# EAGLE design Genesis - Multitap (EAGLE 9.6.2)
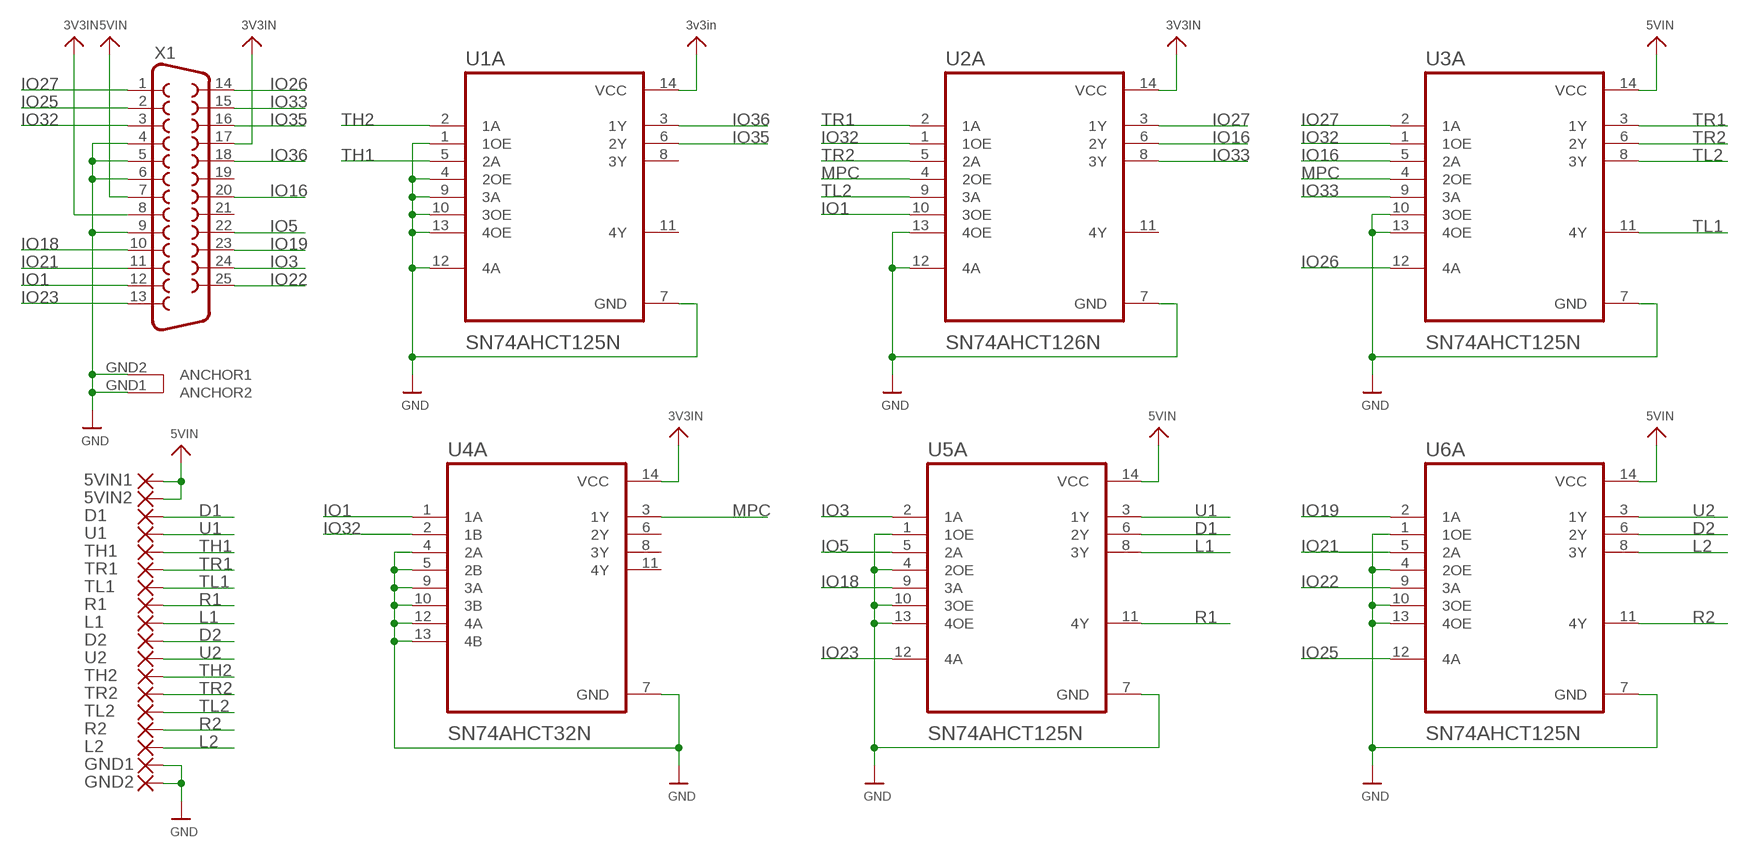
[diagram p0: schematic, sheet 1]

## Parts
5VIN1  SMD5  [SMD2,54-5,08]
5VIN2  SMD5  [SMD2,54-5,08]
D1  SMD5  [SMD2,54-5,08]
D2  SMD5  [SMD2,54-5,08]
GND1  SMD5  [SMD2,54-5,08]
GND2  SMD5  [SMD2,54-5,08]
L1  SMD5  [SMD2,54-5,08]
L2  SMD5  [SMD2,54-5,08]
R1  SMD5  [SMD2,54-5,08]
R2  SMD5  [SMD2,54-5,08]
TH1  SMD5  [SMD2,54-5,08]
TH2  SMD5  [SMD2,54-5,08]
TL1  SMD5  [SMD2,54-5,08]
TL2  SMD5  [SMD2,54-5,08]
TR1  SMD5  [SMD2,54-5,08]
TR2  SMD5  [SMD2,54-5,08]
U1  SMD5  [SMD2,54-5,08]
U1A  SN74AHCT125N  [DIP794W45P254L1969H508Q14]
U2  SMD5  [SMD2,54-5,08]
U2A  SN74AHCT126N  SN74AHCT125N  [DIP794W45P254L1969H508Q14]
U3A  SN74AHCT125N  [DIP794W45P254L1969H508Q14]
U4A  SN74AHCT32N  [DIP794W45P254L1969H508Q14]
U5A  SN74AHCT125N  [DIP794W45P254L1969H508Q14]
U6A  SN74AHCT125N  [DIP794W45P254L1969H508Q14]
X1  DB25_FEMALEHP  [F25HP]

## Nets
3V3IN: U1A.14(VCC) U2A.14(VCC) U4A.14(VCC) X1.8 X1.17 ; supply symbol labelled 3v3in
5VIN: 5VIN1.1(P) 5VIN2.1(P) U3A.14(VCC) U5A.14(VCC) U6A.14(VCC) X1.7
D1: D1.1(P) U5A.6(2Y)
D2: D2.1(P) U6A.6(2Y)
GND: GND1.1(P) GND2.1(P) U1A.1(1OE) U1A.4(2OE) U1A.7(GND) U1A.9(3A) U1A.10(3OE) U1A.12(4A) U1A.13(4OE) U2A.7(GND) U2A.12(4A) U2A.13(4OE) U3A.7(GND) U3A.10(3OE) U3A.13(4OE) U4A.4(2A) U4A.5(2B) U4A.7(GND) U4A.9(3A) U4A.10(3B) U4A.12(4A) U4A.13(4B) U5A.1(1OE) U5A.4(2OE) U5A.7(GND) U5A.10(3OE) U5A.13(4OE) U6A.1(1OE) U6A.4(2OE) U6A.7(GND) U6A.10(3OE) U6A.13(4OE) X1.4 X1.5 X1.6 X1.9 X1.GND1(ANCHOR2) X1.GND2(ANCHOR1)
IO1: U2A.10(3OE) U4A.1(1A) X1.12
IO3: U5A.2(1A) X1.24
IO5: U5A.5(2A) X1.22
IO16: U2A.6(2Y) U3A.5(2A) X1.20
IO18: U5A.9(3A) X1.10
IO19: U6A.2(1A) X1.23
IO21: U6A.5(2A) X1.11
IO22: U6A.9(3A) X1.25
IO23: U5A.12(4A) X1.13
IO25: U6A.12(4A) X1.2
IO26: U3A.12(4A) X1.14
IO27: U2A.3(1Y) U3A.2(1A) X1.1
IO32: U2A.1(1OE) U3A.1(1OE) U4A.2(1B) X1.3
IO33: U2A.8(3Y) U3A.9(3A) X1.15
IO35: U1A.6(2Y) X1.16
IO36: U1A.3(1Y) X1.18
L1: L1.1(P) U5A.8(3Y)
L2: L2.1(P) U6A.8(3Y)
MPC: U2A.4(2OE) U3A.4(2OE) U4A.3(1Y)
R1: R1.1(P) U5A.11(4Y)
R2: R2.1(P) U6A.11(4Y)
TH1: TH1.1(P) U1A.5(2A)
TH2: TH2.1(P) U1A.2(1A)
TL1: TL1.1(P) U3A.11(4Y)
TL2: TL2.1(P) U2A.9(3A) U3A.8(3Y)
TR1: TR1.1(P) U2A.2(1A) U3A.3(1Y)
TR2: TR2.1(P) U2A.5(2A) U3A.6(2Y)
U1: U1.1(P) U5A.3(1Y)
U2: U2.1(P) U6A.3(1Y)
Unconnected: U1A.8(3Y) U1A.11(4Y) U2A.11(4Y) U4A.6(2Y) U4A.8(3Y) U4A.11(4Y) X1.19 X1.21

## Library data of the parts
5VIN1 5VIN2 D1 D2 GND1 GND2 L1 L2 R1 R2 TH1 TH2 TL1 TL2 TR1 TR2 U1 U2 = wirepad:SMD5: SMD PAD
U1A U2A U3A U5A U6A = SN74AHCT125N:SN74AHCT125N: None Check prices <https://pricing.snapeda.com/parts/SN74AHCT125N/Texas%20Instruments/view-part?ref=eda>; AVAILABILITY: In Stock; DESCRIPTION: Quadruple Bus Buffer Gates With 3-State Outputs 14-PDIP -40 to 125; MF: Texas Instruments; MP: SN74AHCT125N; PACKAGE: PDIP-14 Texas Instruments; PRICE: None; PURCHASE-URL: https://pricing.snapeda.com/search/part/SN74AHCT125N/?ref=eda
U4A = SN74AHCT32N:SN74AHCT32N; DESCRIPTION: 4-ch, 2-input, 4.5-V to 5.5-V OR gates with TTL-compatible CMOS inputs; DIGI-KEY_PART_NUMBER: 2156-SN74AHCT32N-ND; MF: Texas Instruments; MP: SN74AHCT32N; PACKAGE: PDIP-14 Texas Instruments; PURCHASE-URL: https://pricing.snapeda.com/search/part/SN74AHCT32N/?ref=eda
X1 = SparkFun-Retired:DB25_FEMALE: 25 Pin male connector. PCB edge mount for regular PCB thicknesses. This connector will connect directly to the back of a PC parallel port or through a normal DB25 extension cable (M/F). SKU: PRT-08287

## Board
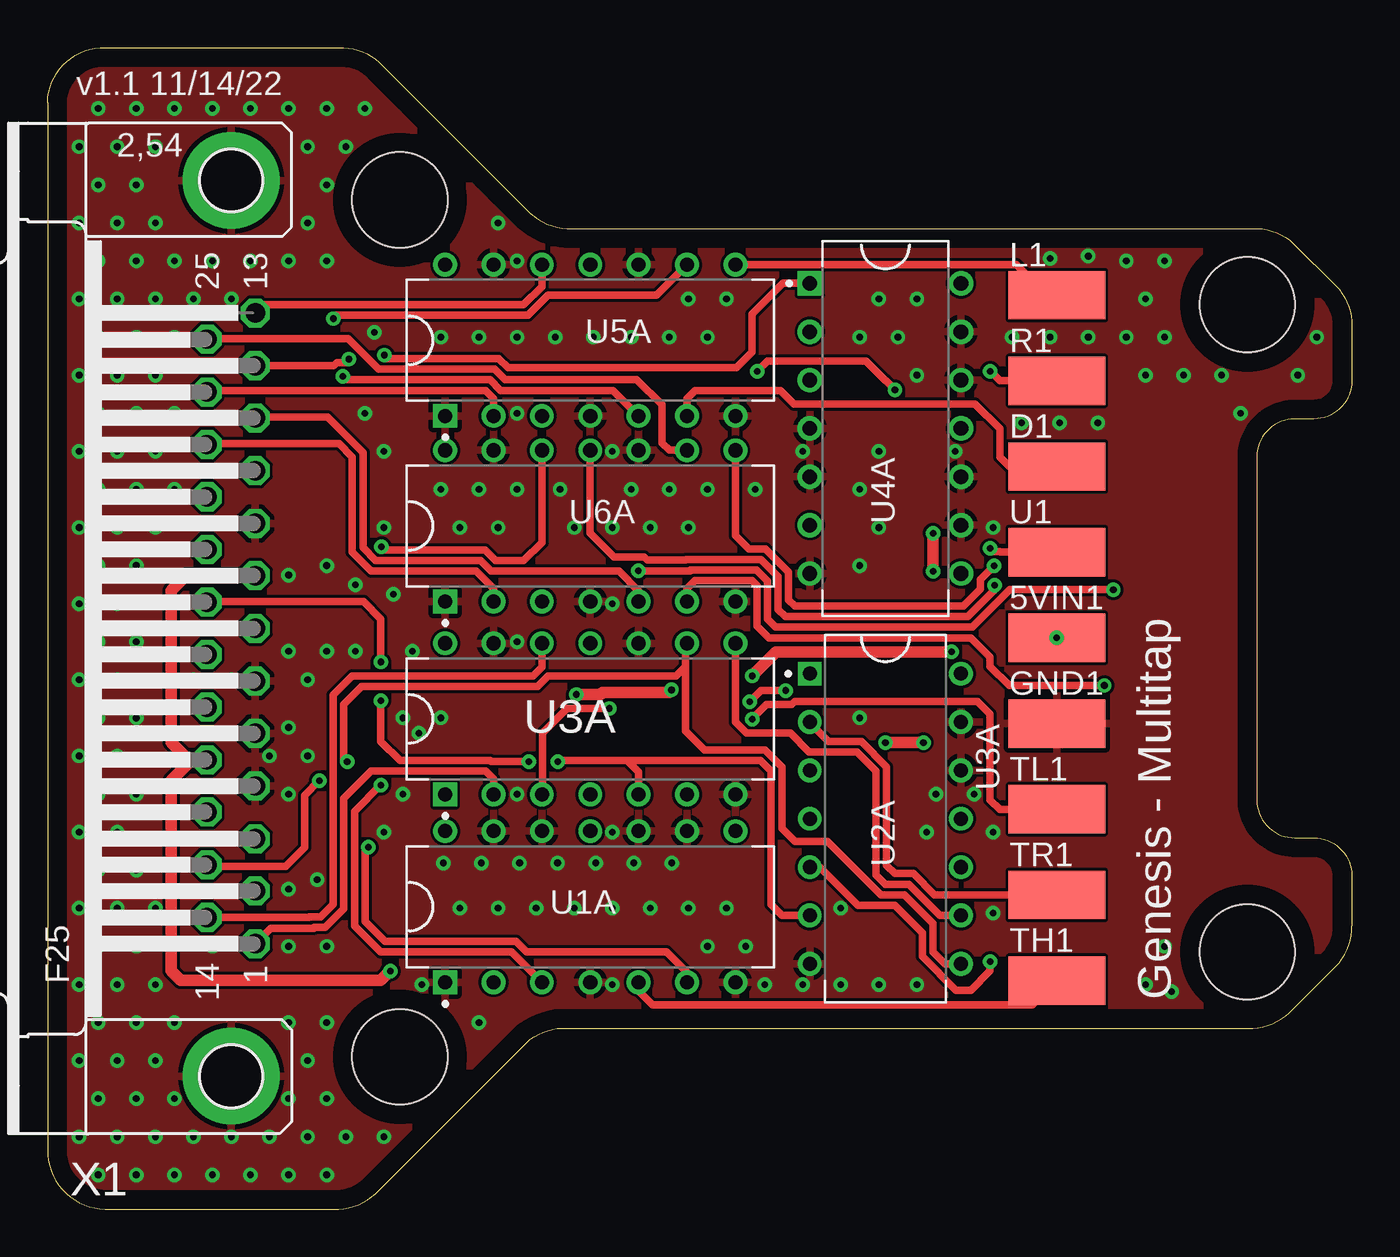
[diagram p1: board, top side]
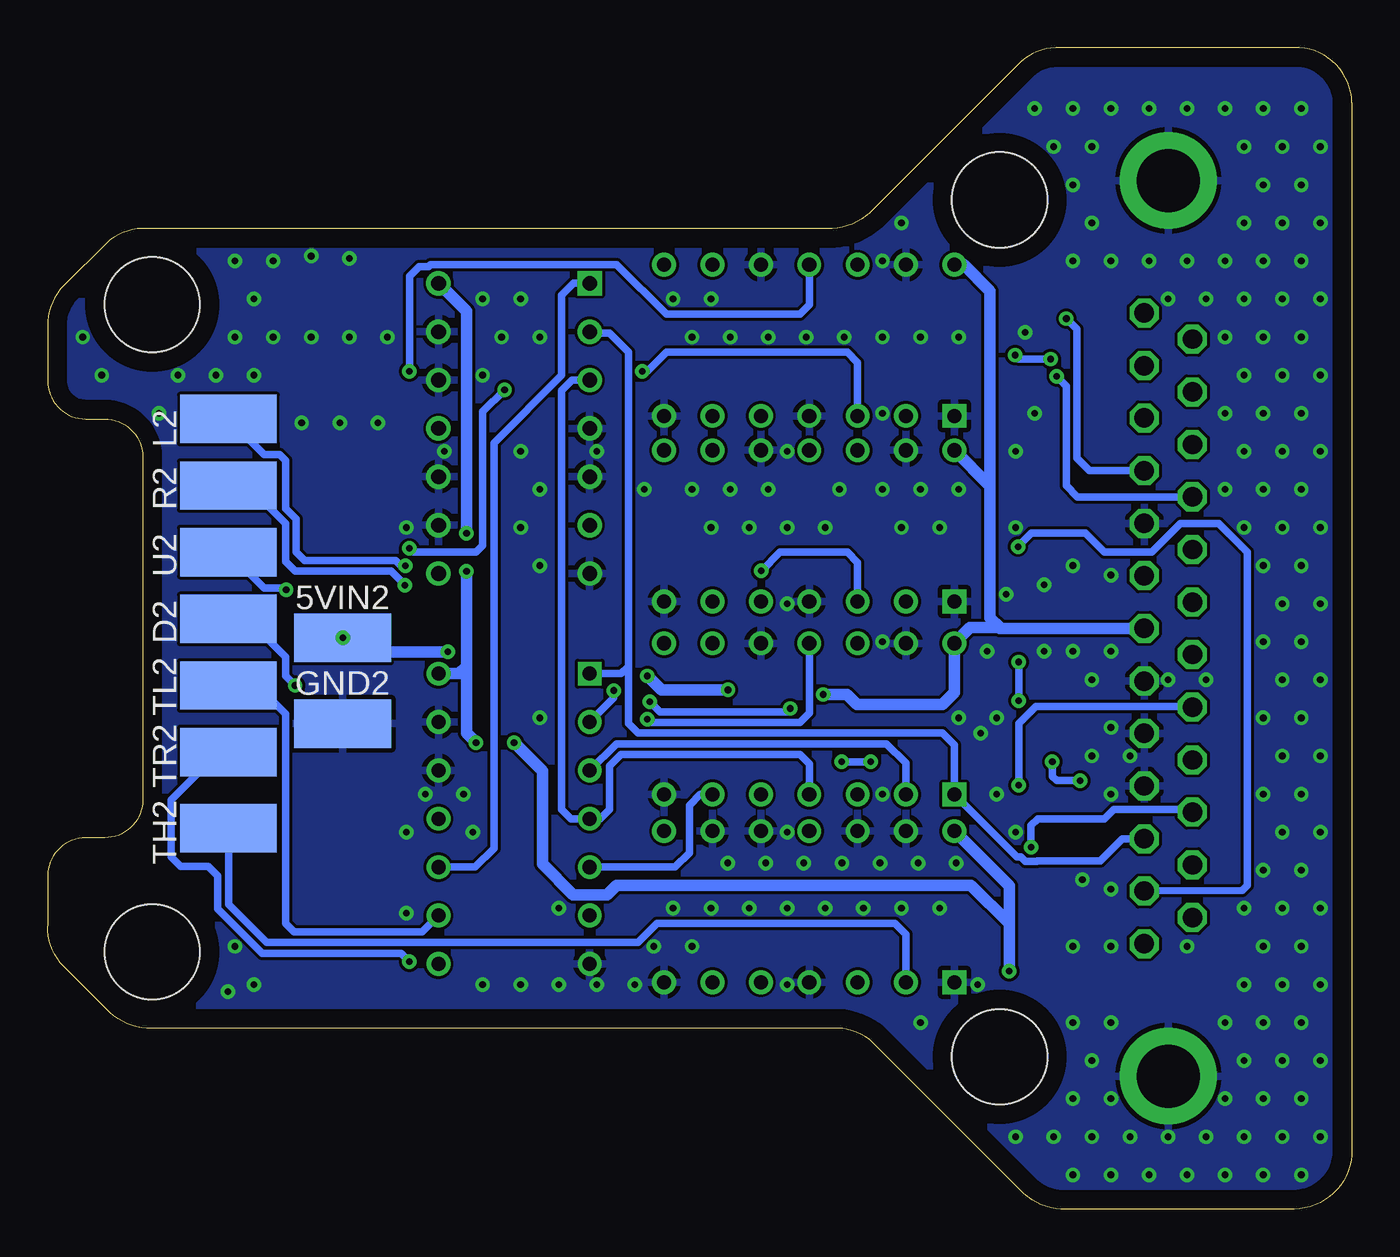
[diagram p2: board, bottom side, seen from below]

Size 68.5 x 61 mm. Coordinates in mm from the lower left corner, seen from the top.
Outline: 0,58.12 0,3.12 arc90 3.03,0 15.29,0 arc45 17.41,1 25.15,8.74 arc-45 27.27,9.5 63.29,9.5 arc45 65.41,10.5 67.65,12.74 arc45 68.5,14.86 68.5,17.5 arc90 66.5,19.5 65.5,19.5 arc-90 63.5,21.5 63.5,39.5 arc-90 65.5,41.5 66.5,41.5 arc90 68.5,43.5 68.5,46.38 arc45 67.65,48.5 65.41,50.74 arc45 63.29,51.5 27.27,51.5 arc-45 25.15,52.5 17.41,60.24 arc45 15.29,61 3.03,61 arc90 0,58.12
Copper layers (1*16): Top 0.035mm / dielectric 1.5mm / Bottom 0.035mm
Design rules "default": minimum track width 6mil, minimum drill 0.35mm, track to track 6mil, track to pad 6mil, pad to pad 6mil, via to via 6mil, smd to smd 6mil, copper to edge 40mil, drill to drill 6mil, minimum pad ring 10mil, minimum via ring 8mil, stop-mask expansion 4mil, vias tented up to drill 0.5mm, thermal gap 10mil
Holes 5 mm at 63,13.5 63,47.5 18.5,53 18.5,8

### Footprints (pad centres in the part's own frame; a part is rotated, then mirrored left to right if it is on the bottom)
SMD2,54-5,08 = smd 2.54 x 5.08: 1 0,0
DIP794W45P254L1969H508Q14 = drill 0.74 pad 1.14 square: 1 -3.97,7.62 | drill 0.74 pad 1.14: 2 -3.97,5.08; 3 -3.97,2.54; 4 -3.97,0; 5 -3.97,-2.54; 6 -3.97,-5.08; 7 -3.97,-7.62; 8 3.97,-7.62; 9 3.97,-5.08; 10 3.97,-2.54; 11 3.97,0; 12 3.97,2.54; 13 3.97,5.08; 14 3.97,7.62
DIP794W45P254L1969H508Q14' = drill 0.77 pad 1.17 square: 1 -3.97,7.62 | drill 0.77 pad 1.17: 2 -3.97,5.08; 3 -3.97,2.54; 4 -3.97,0; 5 -3.97,-2.54; 6 -3.97,-5.08; 7 -3.97,-7.62; 8 3.97,-7.62; 9 3.97,-5.08; 10 3.97,-2.54; 11 3.97,0; 12 3.97,2.54; 13 3.97,5.08; 14 3.97,7.62
F25HP = drill 1.016 octagon: 1 -16.561,-1.27; 2 -13.792,-1.27; 3 -11.049,-1.27; 4 -8.28,-1.27; 5 -5.512,-1.27; 6 -2.769,-1.27; 7 0,-1.27; 8 2.769,-1.27; 9 5.512,-1.27; 10 8.28,-1.27; 11 11.049,-1.27; 12 13.792,-1.27; 13 16.561,-1.27; 14 -15.189,1.27; 15 -12.421,1.27; 16 -9.652,1.27; 17 -6.909,1.27; 18 -4.14,1.27; 19 -1.372,1.27; 20 1.372,1.27; 21 4.14,1.27; 22 6.909,1.27; 23 9.652,1.27; 24 12.421,1.27; 25 15.189,1.27 | drill 3.302 pad 5.08: GND1 -23.52,0; GND2 23.52,0

### Placement (x,y rotation side)
5VIN1  53,30 270 top
5VIN2  53,30 270 bottom
D1  53,39 270 top
D2  59,31 270 bottom
GND1  53,25.5 270 top
GND2  53,25.5 270 bottom
L1  53,48 270 top
L2  59,41.5 270 bottom
R1  53,43.5 270 top
R2  59,38 270 bottom
TH1  53,12 270 top
TH2  59,20 270 bottom
TL1  53,21 270 top
TL2  59,27.5 270 bottom
TR1  53,16.5 270 top
TR2  59,24 270 bottom
U1  53,34.5 270 top
U1A  28.5,15.88 90 top
U2  59,34.5 270 bottom
U2A  44,20.5 0 top
U3A  28.5,25.75 90 top
U4A  SN74AHCT32N  [DIP794W45P254L1969H508Q14']  44,41 0 top
U5A  28.5,45.63 90 top
U6A  28.5,35.88 90 top
X1  9.64,30.5 90 top

### Tracks (layer width: path | path; a pad name or v marks a point on that pad's centre or on a via)
3V3IN  (via drill 0.35)
  Top 0.61: 7.37,23.63 6.5,24.5 6.5,32.5 7.27,33.27 X1.8 | 7.37,23.63 7.37,23.37 6.5,22.5 6.5,12.5 7,12 17.5,12 v18,12.5 | X1.17 7.41,23.59 7.37,23.63 | v46.5,33.5 v46.5,35.5 | v44,24.5 v46,24.5
  Bottom 0.61: v18,12.5 18,15 | 18,15 18,16.97 U1A.14 | U2A.14 46.88,28.12 46.5,28.5 | v46.5,35.5 46.5,47.15 U4A.14 | 46.5,28.5 v46.5,33.5 | 18,15 20,17 38.63,17 39.12,16.51 40.89,16.51 42.5,18.12 42.5,23 v44,24.5 | v46,24.5 46.5,25 46.5,28.5
5VIN  (via drill 0.35)
  Top 0.61: v27.77,27.03 29.05,27.03 29.15,27.13 32.63,27.13 v32.77,27.27 | v37,28 38.27,29.27 v47.48,29.27
  Bottom 0.61: 18.5,30.54 20.06,30.54 U3A.14 20.88,27.12 21.5,26.5 26,26.5 26.53,27.03 v27.77,27.03 | 18.5,30.54 19,31.04 19,37.97 | 19,37.97 U6A.14 | 19,37.97 19,48.22 20.38,49.6 U5A.14 | X1.7 18.5,30.5 18.5,30.54 | v32.77,27.27 36.27,27.27 v37,28 | v47.48,29.27 52.27,29.27 5VIN2.1
  other vias: 53,30
D1
  Top 0.406: U5A.6 33.58,42.58 34,43 38.5,43 39.21,42.29 48.71,42.29 50,41 50,39.5 50.5,39 D1.1
D2  (via drill 0.35)
  Top 0.406: U6A.6 33.58,32.58 34,33 37,33 37.25,32.75 37.25,30.63 37.87,30 48.5,30 49.5,29 49.5,28.5 50.5,27.5 v55.5,27.5
  Bottom 0.406: D2.1 58.75,31.25 58.25,31.25 56,29 56,28 v55.5,27.5
GND  (via drill 0.35)
  other vias: 19.5,25 2.66,1.8 1.66,3.8 2.66,5.8 1.66,7.8 2.66,9.8 1.66,11.8 2.66,13.8 1.66,15.8 2.66,17.8 1.66,19.8 2.66,21.8 1.66,23.8 2.66,25.8 1.66,27.8 2.66,29.8 1.66,31.8 2.66,33.8 1.66,35.8 2.66,37.8 1.66,39.8 2.66,41.8 1.66,43.8 2.66,45.8 1.66,47.8 2.66,49.8 1.66,51.8 2.66,53.8 1.66,55.8 2.66,57.8 4.66,1.8 3.66,3.8 4.66,5.8 3.66,7.8 4.66,9.8 3.66,11.8 4.66,13.8 3.66,15.8 4.66,17.8 3.66,19.8 4.66,21.8 3.66,23.8 4.66,25.8 3.66,27.8 4.66,29.8 3.66,31.8 4.66,33.8 3.66,35.8 4.66,37.8 3.66,39.8 4.66,41.8 3.66,43.8 4.66,45.8 3.66,47.8 4.66,49.8 3.66,51.8 4.66,53.8 3.66,55.8 4.66,57.8 6.66,1.8 5.66,3.8 6.66,5.8 5.66,7.8 6.66,9.8 5.66,11.8 5.66,15.8 5.66,35.8 6.66,37.8 5.66,39.8 6.66,41.8 5.66,43.8 6.66,45.8 5.66,47.8 6.66,49.8 5.66,51.8 5.66,55.8 6.66,57.8 8.66,1.8 7.66,3.8 12.66,16.8 14.16,17.3 8.66,13.8 7.66,27.8 7.66,47.8 8.66,49.8 8.66,57.8 10.66,1.8 9.66,3.8 9.66,27.8 9.66,47.8 10.66,49.8 10.66,57.8 12.66,1.8 11.66,3.8 12.66,5.8 12.66,9.8 12.66,13.8 12.66,21.8 11.66,23.8 12.66,25.3 12.66,29.3 12.66,33.3 12.66,49.8 12.66,57.8 14.66,1.8 13.66,3.8 14.66,5.8 13.66,7.8 14.66,9.8 14.66,13.8 13.66,23.8 13.66,27.8 14.66,29.3 14.66,33.8 14.66,49.8 13.66,51.8 14.66,53.8 13.66,55.8 14.66,57.8 15.66,3.8 16.16,29.3 16.66,41.8 17.16,46.05 15.66,55.8 16.66,57.8 17.66,3.8 17.66,19.8 18.66,21.8 18.66,25.8 19.16,29.3 16.16,32.8 17.66,35.8 17.66,39.8 19.66,11.8 20.78,18.18 20.66,25.8 18.16,32.3 20.66,37.8 20.66,45.8 22.66,9.8 21.66,15.8 22.78,18.18 21.66,35.8 22.66,37.8 22.66,45.8 23.66,15.8 24.78,18.18 24.66,21.8 24.66,29.8 23.66,35.8 24.66,37.8 24.66,41.8 24.66,45.8 24.66,49.8 23.66,51.8 25.66,15.8 26.78,18.18 26.91,37.8 26.66,45.8 27.66,15.8 28.78,18.18 27.66,35.8 28.66,45.8 29.66,11.8 29.66,15.8 30.78,18.18 29.66,19.8 29.66,31.8 29.66,35.8 30.66,37.8 29.66,39.8 30.66,45.8 31.66,15.8 32.78,18.18 31.66,35.8 32.66,37.8 32.66,45.8 34.66,13.8 33.66,15.8 33.66,35.8 34.66,37.8 34.66,45.8 33.66,47.8 36.66,13.8 35.66,15.8 37.16,37.8 35.66,47.8 37.66,11.8 39.66,11.8 39.66,39.8 41.66,11.8 41.66,15.8 42.66,25.8 42.66,33.8 42.66,37.8 42.66,45.8 43.66,11.8 43.66,35.8 43.66,39.8 44.66,45.8 43.66,47.8 45.66,11.8 46.16,19.8 46.66,21.8 45.66,43.8 45.66,47.8 48.66,21.8 47.66,39.8 49.66,15.54 49.66,19.8 49.66,35.8 51.16,41.3 50.66,45.8 53.16,41.3 52.66,45.8 52.66,49.92 55.16,41.3 54.66,45.8 54.66,50.05 56.66,45.8 56.66,49.8 57.66,11.8 58.66,13.8 57.66,43.8 58.66,45.8 57.66,47.8 58.66,49.8 59.02,11.42 59.66,43.8 62.66,41.8 61.66,43.8 65.66,43.8 66.66,45.8
  pour Bottom: 0,0 0,61.12 28.53,61.12 28.53,51.62 69.03,51.62 69.03,9.5 28.03,9.5 28.03,0
  pour Top: 0,0 0,61.12 28.53,61.12 28.53,51.62 69.03,51.62 69.03,9.5 28.03,9.5 28.03,0
IO1  (via drill 0.35)
  Top 0.406: X1.12 15.02,44.29 15.2,44.47 15.64,44.47 v15.82,44.64 | v17.69,44.85 17.86,44.68 23.69,44.68 24.18,44.19 36.19,44.19 37,45 37,47 38.62,48.62 U4A.1
  Bottom 0.406: U4A.1 40.88,48.62 41.5,48 41.5,43.79 45.06,40.23 45.06,18.94 46.04,17.96 U2A.10 | v15.82,44.64 17.48,44.64 v17.69,44.85
IO3
  Top 0.406: U5A.2 23.42,42.58 23,43 8.45,43 X1.24
IO5  (via drill 0.35)
  Top 0.406: U5A.5 29.7,43 23.79,43 23.23,43.56 15.68,43.56 v15.5,43.73
  Bottom 0.406: v15.5,43.73 15,43.23 15,40 15,38 14.41,37.41 X1.22
IO16  (via drill 0.35)
  Top 0.406: U3A.5 31.04,22.96 30.44,23.56 | v17.5,26.71 17.5,24.56 18.5,23.56 23.23,23.56 23.29,23.5 v25.27,23.5 | v17.5,28.73 17.5,31 16.59,31.91 8.37,31.91 X1.20 | U2A.6 38.58,15.42 38,16 38,23 37.44,23.56 30.44,23.56 | 30.44,23.56 26.86,23.56 v26.8,23.5
  Bottom 0.406: v17.5,26.71 v17.5,28.73 | v26.8,23.5 v25.27,23.5
IO18  (via drill 0.35)
  Top 0.406: U5A.9 31.98,48 26.29,48 25.23,46.94 15.18,46.94 v15,46.77
  Bottom 0.406: v15,46.77 14.44,46.21 14.44,39.44 14,39 13.82,38.82 13.78,38.78 X1.10
IO19
  Top 0.406: U6A.2 23.42,32.58 22.5,33.5 17,33.5 16,34.5 16,39.5 15.31,40.19 8.41,40.19 X1.23
IO21
  Top 0.406: U6A.5 31.04,32.46 30,33.5 23.29,33.5 22.73,34.06 17.23,34.06 16.56,34.73 16.56,39.73 14.7,41.59 10.95,41.59 X1.11
IO22
  Top 0.406: U6A.9 32.65,39.85 32.26,40.24 32.26,42.24 30.94,43.56 24.02,43.56 23.46,44.12 17.38,44.12 15.77,45.73 8.41,45.73 X1.25
IO23
  Top 0.406: U5A.12 25.96,48.46 25,47.5 11.35,47.5 X1.13
IO25  (via drill 0.35)
  Top 0.406: U6A.12 25.96,35.02 25,34.06 23.52,34.06 22.96,34.62 17.71,34.62 v17.54,34.79
  Bottom 0.406: v17.54,34.79 16.83,35.5 14,35.5 13,34.5 10.5,34.5 9,36 7,36 5.5,34.5 5.5,17 5.75,16.75 X1.2
IO26
  Top 0.406: U3A.12 25.96,28.46 25.5,28 16,28 15,27 15,16 14.35,15.35 13.73,15.35 13.73,15.31 X1.14
IO27
  Top 0.406: U3A.2 23.42,22.58 23,23 17,23 15.56,21.56 15.56,15.77 14.58,14.79 14.01,14.79 13.96,14.75 11.72,14.75 X1.1
  Bottom 0.406: U2A.3 38.63,24.44 24.44,24.44 23.42,23.42 U3A.2
IO32
  Bottom 0.406: U4A.2 39.95,46 39,46 38,45 38,28.5 | 38,28.5 38,25.5 37.5,25 21.5,25 20.88,24.38 U3A.1 17.6,18.5 17.39,18.5 17.16,18.27 16.55,18.27 16.53,18.29 13.21,18.29 12.05,19.45 X1.3 | U2A.1 38.38,28.12 38,28.5
IO33  (via drill 0.35)
  Top 0.406: U3A.9 33.5,29.64 33.5,28.5 | 33.5,28.5 33,28 26.29,28 25.73,27.44 16.5,27.44 15.56,26.5 15.56,23.68 v15.73,23.5 | v14.27,22.5 13.5,21.73 13.5,19 12.5,18 8.37,18 X1.15 | U2A.8 47.12,12.88 46.5,13.5 46.5,15 45,16.5 43.77,16.5 40.97,19.3 39.26,19.3 38.56,20 38.56,23.23 37.67,24.12 34.5,24.12 33.5,25.12 33.5,28.5
  Bottom 0.406: v15.73,23.5 15.73,22.73 15.5,22.5 v14.27,22.5
IO35  (via drill 0.35)
  Top 0.406: U1A.6 33.58,12.42 32.5,13.5 25.16,13.5 24.6,14.06 17.73,14.06 16.68,15.11 16.68,18.82 v16.85,19
  Bottom 0.406: v16.85,19 16.85,20.15 16.5,20.5 13,20.5 12.5,21 8.37,21 X1.16
IO36  (via drill 0.35)
  Top 0.406: U1A.3 24.37,13.5 17.5,13.5 16.12,14.88 16.12,20.88 v17.5,22.27
  Bottom 0.406: v17.5,22.27 17.5,25.5 16.6,26.4 8.37,26.4 X1.18
L1
  Top 0.406: U5A.8 39.23,49.6 39.24,49.62 50.88,49.62 52.5,48 L1.1
L2  (via drill 0.35)
  Top 0.406: v49.71,33.79 49,33.07 49,32.58 48.1,31.68 39.25,31.68 38.92,32 38.92,33.45 37.69,34.68 36.82,34.68 36.12,35.38 U6A.8
  Bottom 0.406: L2.1 57.13,39.63 56.31,39.63 56,39.31 56,36.79 55.44,36.23 55.44,34.5 55,34.06 50.23,34.06 49.96,33.79 v49.71,33.79
MPC
  Bottom 0.406: U4A.3 40.96,43.54 41.5,43 41.5,21 41,20.5 U2A.4 39.5,20.5 39,21 39,23.28 38.4,23.88 29,23.88 28.5,23.38 U3A.4
R1  (via drill 0.35)
  Top 0.406: v49.5,44 50,43.5 R1.1
  Bottom 0.406: U5A.11 28.5,47.5 29,47 36,47 38.62,49.62 48.38,49.62 48.5,49.5 49,49.5 49.5,49 v49.5,44
R2  (via drill 0.35)
  Top 0.406: U6A.11 28.5,35.5 29.75,34.25 31.32,34.25 31.5,34.08 33.5,34.08 33.54,34.12 37.46,34.12 38.36,33.22 38.36,31.5 38.75,31.12 48.33,31.12 49.73,32.52 v49.73,32.77
  Bottom 0.406: v49.73,32.77 50.46,33.5 55.5,33.5 56,34 56,36 58,38 R2.1
TH1
  Top 0.406: U1A.5 31.04,11.46 31.78,10.72 51.72,10.72 TH1.1
TH2
  Bottom 0.406: U1A.2 23.42,14.42 24,15 36.5,15 37.5,14 57,14 59,16 TH2.1
TL1  (via drill 0.35)
  Top 0.406: v37,25.73 37.77,26.5 39.07,26.5 39.24,26.67 48.83,26.67 49.5,26 49.5,21.5 50,21 TL1.1
  Bottom 0.406: v37,25.73 36.83,25.56 29,25.56 28.5,26.06 U3A.11
TL2
  Top 0.406: U3A.8 36.12,25.58 36.7,25 39.01,25 39.99,24.02 40.44,24.02 40.45,24 42.5,24 43.5,23 43.5,17.56 44,17.06 45.23,17.06 46.87,15.42 U2A.9
  Bottom 0.406: U2A.9 48.83,14.56 55.56,14.56 56,15 56,26 57.5,27.5 TL2.1
TR1  (via drill 0.35)
  Top 0.406: TR1.1 46.58,16.5 45.46,17.62 44.5,17.62 44.06,18.06 44.06,23.23 42.73,24.56 41,24.56 40.03,25.53 U2A.2 | v38.77,27.23 37.46,27.23 v36.87,26.64 | v29.5,26.29 27.29,26.29 26,25 26,21.82 U3A.3
  Bottom 0.406: U2A.2 38.77,26.84 v38.77,27.23 | v36.87,26.64 36.35,26.12 29.68,26.12 v29.5,26.29
TR2  (via drill 0.35)
  Top 0.406: U2A.5 40.54,17.96 42.56,15.94 44.5,15.94 45.94,14.5 45.94,13.27 47.71,11.5 48.5,11.5 49.5,12.5 v49.5,13
  Bottom 0.406: U3A.6 34.22,21.78 34.8,21.2 34.8,18.7 35.54,17.96 U2A.5 | v49.5,13 49.94,13.44 57.23,13.44 59.56,15.77 59.56,17.5 60.06,18 61.5,18 62,18.5 62,21.5 59.5,24 TR2.1
U1  (via drill 0.35)
  Top 0.406: v37.27,44 37.8,44.53 42.97,44.53 44,43.5 44.02,43.5 v44.5,43.02 | v49.5,34.7 49.67,34.52 50.02,34.52 50.04,34.5 U1.1
  Bottom 0.406: U5A.3 25.96,44.46 26.5,45 36,45 37,44 v37.27,44 | v49.5,34.7 49.3,34.5 46,34.5 45.64,34.86 45.64,41.88 v44.5,43.02
U2  (via drill 0.35)
  Top 0.406: v31.02,33.52 33.73,33.52 33.77,33.56 37.23,33.56 37.8,32.98 37.8,30.98 38.23,30.56 48.56,30.56 50.53,32.53 v55.97,32.53
  Bottom 0.406: U6A.3 25.96,33.96 26.5,34.5 30.04,34.5 v31.02,33.52 | v55.97,32.53 56.22,32.53 56.31,32.63 57.13,32.63 U2.1

### Text on the board
tPlace: v1.1 11/14/22 | Genesis - Multitap
tNames: U3A